# EAGLE design Juice Rescue v1.0 (EAGLE 9.6.2)
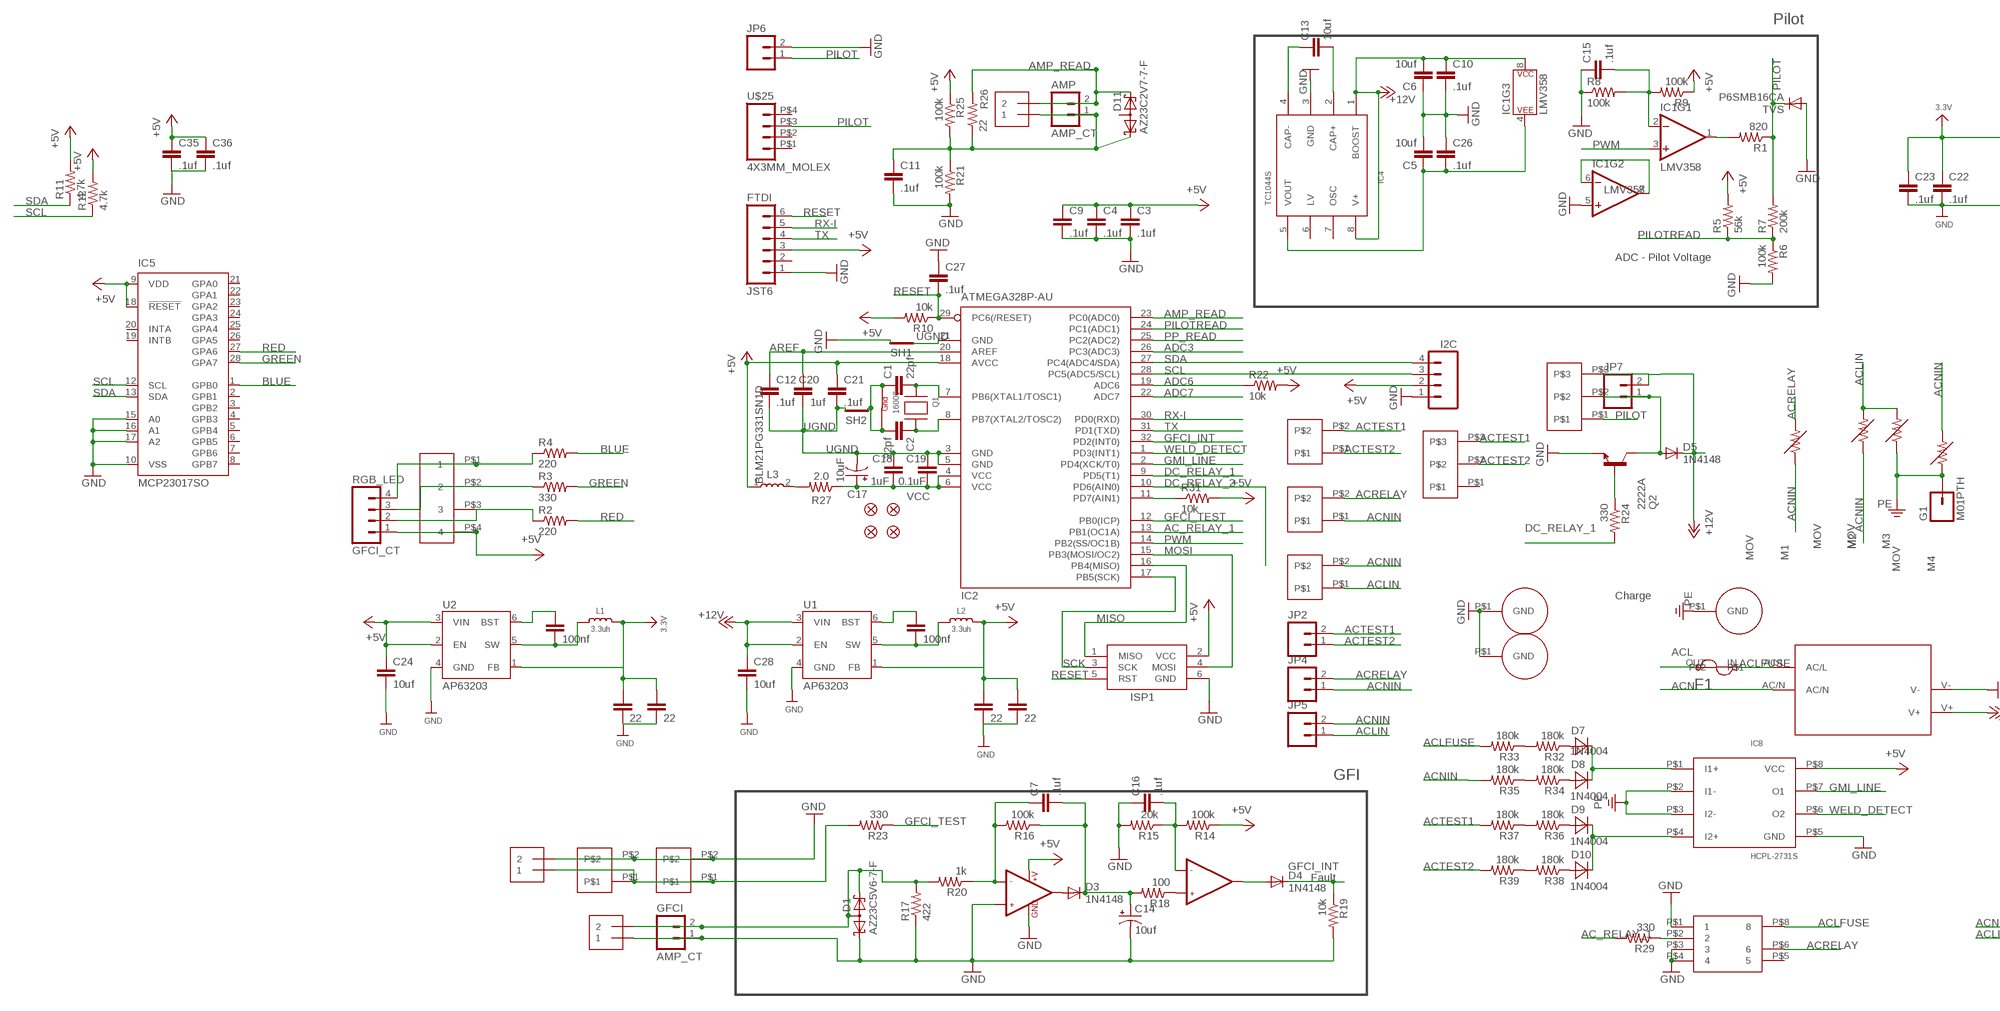
[diagram p0: schematic, sheet 1, part 1 of 2]
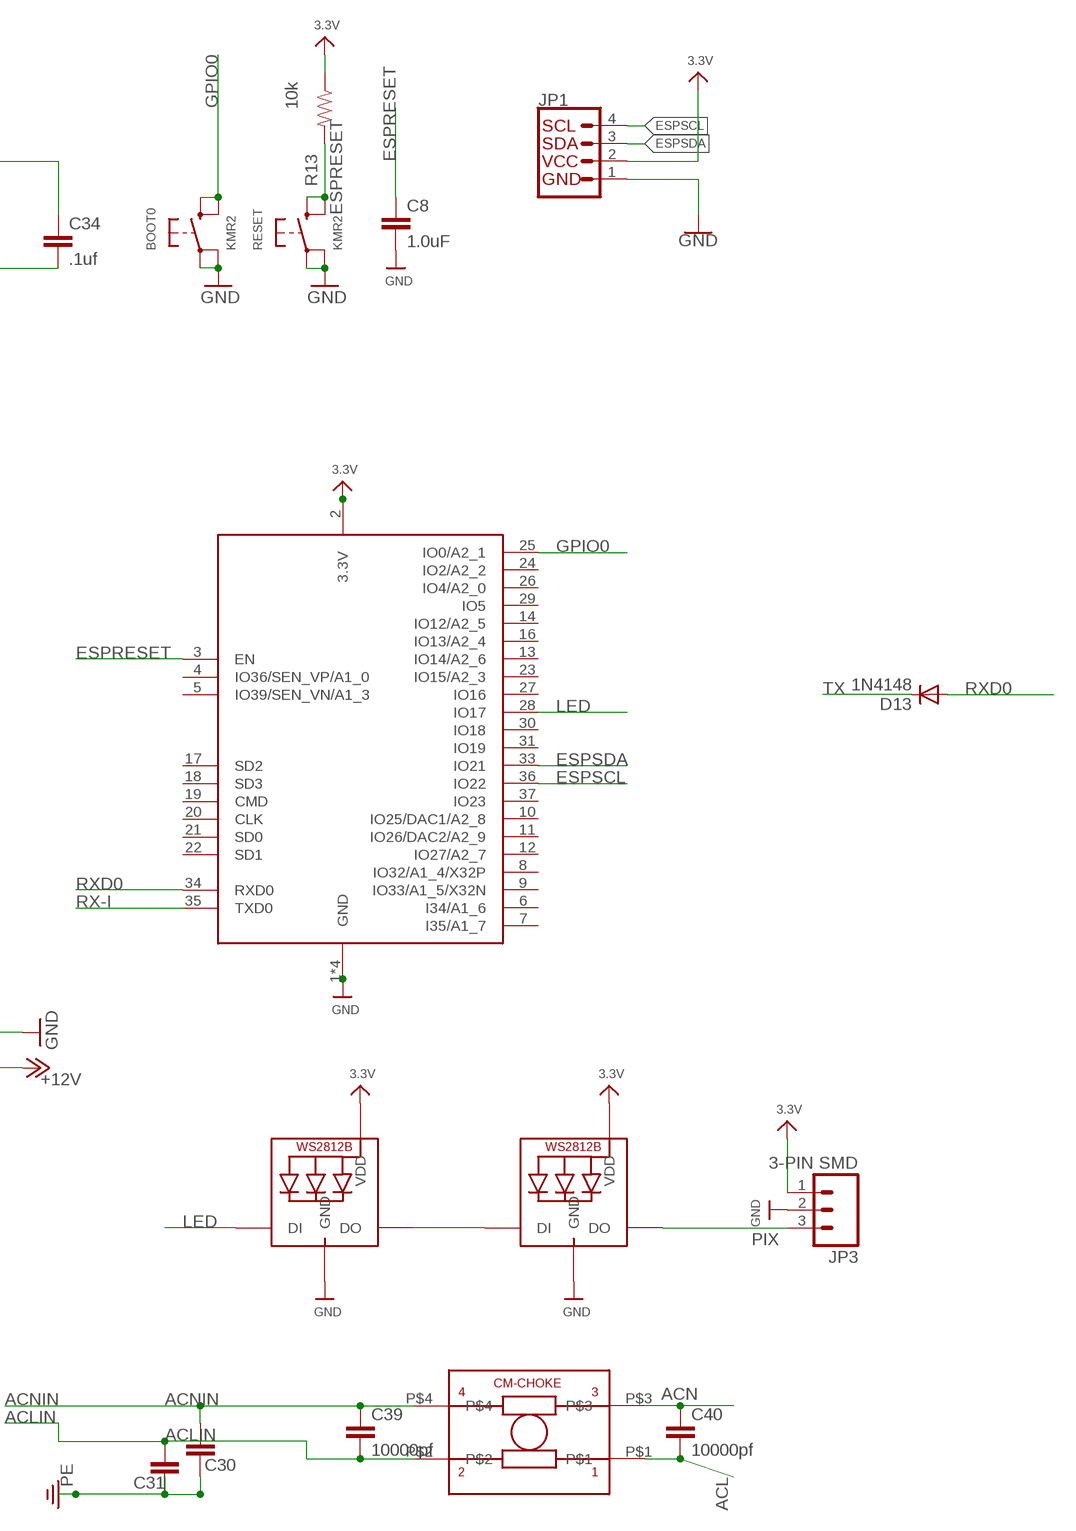
[diagram p1: schematic, sheet 1, part 2 of 2]

## Parts
AMP  AMP_CT  MOLEX_2  [MOLEX_2]
BOOT0  KMR2  SWITCH_TACT_SMT4.6X2.8  [BTN_KMR2_4.6X2.8]
C1  22pf  CAP0805  [0805]
C2  22pf  CAP0805  [0805]
C3  .1uf  CAP0805  [0805]
C4  .1uf  CAP0805  [0805]
C5  10uf  CAP0805  [0805]
C6  10uf  CAP0805  [0805]
C7  .1uf  CAP0805  [0805]
C8  1.0uF  1.0UF-0805-25V-(+80/-20%)  [0805]
C9  .1uf  CAP0805  [0805]
C10  .1uf  CAP0805  [0805]
C11  .1uf  CAP0805  [0805]
C12  .1uf  CAP0805  [0805]
C13  10uf  CAP0805  [0805]
C14  10uf  CAP_POL1206  [EIA3216]
C15  .1uf  CAP0805  [0805]
C16  .1uf  CAP0805  [0805]
C17  10uF  10UF-POLAR-0603-6.3V-20%(TANT)  [0603-POLAR]
C18  1uF  CAP0805  [0805]
C19  0.1uF  CAP0805  [0805]
C20  1uf  CAP0805  [0805]
C21  .1uf  CAP0805  [0805]
C22  .1uf  1.0UF-0805-25V-(+80/-20%)  [0805]
C23  .1uf  1.0UF-0805-25V-(+80/-20%)  [0805]
C24  10uf  1.0UF-0805-25V-(+80/-20%)  [0805]
C25  22  1.0UF-0805-25V-(+80/-20%)  [0805]
C26  .1uf  CAP0805  [0805]
C27  .1uf  CAP0805  [0805]
C28  10uf  1.0UF-0805-25V-(+80/-20%)  [0805]
C29  22  1.0UF-0805-25V-(+80/-20%)  [0805]
C30  100nf  1.0UF-0805-25V-(+80/-20%)  [0805]
C31  22  1.0UF-0805-25V-(+80/-20%)  [0805]
C32  100nf  1.0UF-0805-25V-(+80/-20%)  [0805]
C33  22  1.0UF-0805-25V-(+80/-20%)  [0805]
C34  .1uf  1.0UF-0805-25V-(+80/-20%)  [0805]
C35  .1uf  CAP0805  [0805]
C36  .1uf  CAP0805  [0805]
C37  1000pf  DK1  [DK1E3EA]
C38  1000pf  DK1  [DK1E3EA]
C39  10000pf  C7.5/4  [C7.5B4]
C40  10000pf  C7.5/4  [C7.5B4]
CMC  RN214-0.3-02-47M  [RN214-0.3-02-47M]
D1  AZ23C5V6-7-F  BAS40-06  [SOT23]
D3  1N4148  DIODE-SOD123  [SOD123]
D4  1N4148  DIODE-SOD123  [SOD123]
D5  1N4148  DIODE-SOD123  [SOD123]
D7  1N4004  MBRA340T3  [SMA]
D8  1N4004  MBRA340T3  [SMA]
D9  1N4004  MBRA340T3  [SMA]
D10  1N4004  MBRA340T3  [SMA]
D11  AZ23C2V7-7-F  BAS40-06  [SOT23]
D13  1N4148  DIODE-SOD123  [SOD123]
F1  BEL1.6AFUSE  BEL1AFUSE  [BELFUSE1A]
FID1  FIDUCIAL1X2.5  [FIDUCIAL-1X2.5]
FID2  FIDUCIAL1X2.5  [FIDUCIAL-1X2.5]
FID3  FIDUCIAL1X2.5  [FIDUCIAL-1X2.5]
FID4  FIDUCIAL1X2.5  [FIDUCIAL-1X2.5]
FTDI  JST6  [JST6]
G1  M01PTH  [1X01]
GFCI  AMP_CT  MOLEX_2  [MOLEX_2]
I2C  M04JST-PTH-VERT  [JST-4-PTH-VERT]
IC1  LMV358  LMV358SOIC  [SO08]
IC2  ATMEGA328P-AU  MEGA8-AI  [TQFP32-08]
IC3  LM358  LMV358  [SO08]
IC4  TC1044S  [SO-8]
IC5  MCP23017SO  [SO28W]
IC7  AQH2223  [SIL8]
IC8  HCPL-2731S  [SIL8-2]
ISP1  ISP1  AVRISP-6  [AVRISP]
J1  1X2-3.5MM  [1X2-3.5MM]
J2  1X2-3.5MM  [1X2-3.5MM]
J3  1X2-3.5MM  [1X2-3.5MM]
JP1  QWIIC_CONNECTORJS-1MM  [JST04_1MM_RA]
JP2  M025MM  [SCREWTERMINAL-5MM-2]
JP3  3-PIN SMD  M03JST-SMD  [JST-3-SMD]
JP4  M025MM  [SCREWTERMINAL-5MM-2]
JP5  M025MM  [SCREWTERMINAL-5MM-2]
JP6  M025MM  [SCREWTERMINAL-5MM-2]
JP7  M025MM  [SCREWTERMINAL-5MM-2]
L1  3.3uh  MICROBUILDER_INDUCTORNR5040  [MICROBUILDER_INDUCTOR_5X5MM_NR5040_NOTHERMALS]
L2  3.3uh  MICROBUILDER_INDUCTORNR5040  [MICROBUILDER_INDUCTOR_5X5MM_NR5040_NOTHERMALS]
L3  BLM21PG331SN1D  [INDC2012X87]
LED1  WS2812B3535  [LED3535]
LED2  WS2812B3535  [LED3535]
M1  MOV  [MOV]
M2  MOV  [MOV]
M3  MOV  [MOV]
M4  MOV  [MOV]
PS1  IRM-10-5  [IRM-10-5]
Q1  16000  XTAL-4-3225  [NX3225]
Q2  2222A  BCX70SMD  [SOT23]
R1  820  RESISTOR0805-RES  [0805]
R2  220  RESISTOR0805-RES  [0805]
R3  330  RESISTOR0805-RES  [0805]
R4  220  RESISTOR0805-RES  [0805]
R5  56k  RESISTOR0805-RES  [0805]
R6  100k  RESISTOR0805-RES  [0805]
R7  200k  RESISTOR0805-RES  [0805]
R8  100k  RESISTOR0805-RES  [0805]
R9  100k  RESISTOR0805-RES  [0805]
R10  10k  RESISTOR0805-RES  [0805]
R11  4.7k  RESISTOR0805-RES  [0805]
R12  4.7k  RESISTOR0805-RES  [0805]
R13  10k  RESISTOR0805  [0805]
R14  100k  RESISTOR0805-RES  [0805]
R15  20k  RESISTOR0805-RES  [0805]
R16  100k  RESISTOR0805-RES  [0805]
R17  422  RESISTOR0805-RES  [0805]
R18  100  RESISTOR0805-RES  [0805]
R19  10k  RESISTOR0805-RES  [0805]
R20  1k  RESISTOR0805-RES  [0805]
R21  100k  RESISTOR0805-RES  [0805]
R22  10k  RESISTOR0805-RES  [0805]
R23  330  RESISTOR0805-RES  [0805]
R24  330  RESISTOR0805-RES  [0805]
R25  100k  RESISTOR0805-RES  [0805]
R26  22  R-US_R1206  [R1206]
R27  2.0  RESISTOR0805-RES  [0805]
R29  330  RESISTOR0805-RES  [0805]
R31  10k  RESISTOR0805-RES  [0805]
R32  180k  0.1OHM-1/2W-1%(1210)  [1210]
R33  180k  0.1OHM-1/2W-1%(1210)  [1210]
R34  180k  0.1OHM-1/2W-1%(1210)  [1210]
R35  180k  0.1OHM-1/2W-1%(1210)  [1210]
R36  180k  0.1OHM-1/2W-1%(1210)  [1210]
R37  180k  0.1OHM-1/2W-1%(1210)  [1210]
R38  180k  0.1OHM-1/2W-1%(1210)  [1210]
R39  180k  0.1OHM-1/2W-1%(1210)  [1210]
RESET  KMR2  SWITCH_TACT_SMT4.6X2.8  [BTN_KMR2_4.6X2.8]
RGB_LED  GFCI_CT  GFCI_4  [GFCI_4]
SH1  SHORT-HT5  [SHORT_TOP-50]
SH2  SHORT-HT5  [SHORT_TOP-50]
TVS  P6SMB16CA  DIODE-SMB  [SMB]
U1  AP63203  [SOT23-6]
U2  AP63203  [SOT23-6]
U$1  AMPAC  [AMPAC]
U$3  HOLE  [HOLE]
U$8  AMPAC  [AMPAC]
U$9  HOLE  [HOLE]
U$14  AMPAC  [AMPAC]
U$17  AMPAC  [AMPAC]
U$20  AMP3POS  [AMP3POS]
U$22  AMPAC3P  [ACAMP3P]
U$23  2X4MM  [2X4MM]
U$24  4X1MMRIBBON  [4X1MMRIBBON]
U$25  4X3MM_MOLEX  [4X3MM_MOLEX]
U$27  HOLE  [HOLE]
X2  ESP32-WROOM-32  ESP32_WROOM32_SKINNY  [WROOM32_SKINNY]

## Nets
3.3V: C22.1 C23.1 C25.1 C31.1 C34.1 JP1.2 JP3.1 L1.P$2 LED1.2(VDD) LED2.2(VDD) R13.1 U2.1(FB) X2.2(3.3V)
+5V: C3.1 C4.1 C9.1 C21.1 C24.1 C29.1 C33.1 C35.1 C36.1 FTDI.3 I2C.2 IC2.18(AVCC) IC3.8(+V) IC5.9(VDD) IC5.18(!RESET) IC8.P$8(VCC) ISP1.2(VCC) L2.P$2 L3.1 R5.2 R9.1 R10.2 R11.2 R12.2 R14.1 R22.2 R25.1 R31.2 RGB_LED.1 U1.1(FB) U2.2(EN) U2.3(VIN) U$24.P$4
+12V: C6.2 C10.1 C28.1 D5.C IC1.8(P$V+) IC4.1(BOOST) IC4.8(V+) JP7.2 PS1.V+ U1.2(EN) U1.3(VIN) U$20.P$3
-12V1: C5.1 C26.2 IC1.4(P$V-) IC4.5(VOUT)
AC_RELAY_1: IC2.13(PB1(OC1A)) R29.2
ACL: C40.2 CMC.P$1 F1.OUT
ACLFUSE: F1.IN IC7.P$8 PS1.AC/L R33.2
ACLIN: C38.P$2 C39.2 CMC.P$2 JP5.1 M2.P$2 M3.P$2 U$1.P$1
ACN: C40.1 CMC.P$3 PS1.AC/N
ACNIN: C37.P$2 C39.1 CMC.P$4 JP4.1 JP5.2 M1.P$1 M2.P$1 M4.P$2 R35.2 U$1.P$2 U$8.P$1
ACRELAY: IC7.P$6 JP4.2 M1.P$2 U$8.P$2
ACTEST1: JP2.2 R37.2 U$14.P$2 U$22.P$3
ACTEST2: JP2.1 R39.2 U$14.P$1 U$22.P$2
ADC3: IC2.26(PC3(ADC3))
ADC6: IC2.19(ADC6) R22.1
ADC7: IC2.22(ADC7)
AMP_READ: AMP.2 D11.2(K2) IC2.23(PC0(ADC0)) J3.2 R26.2
AREF: C12.1 C20.1 IC2.20(AREF)
BLUE: IC5.1(GPB0) R4.2
DAMP: L3.2 R27.2
DC_RELAY_1: IC2.9(PD5(T1)) R24.2
DC_RELAY_1_O: D5.A JP7.1 Q2.3(C) U$20.P$2
DC_RELAY_1_T: Q2.1(B) R24.1
DC_RELAY_2: IC2.10(PD6(AIN0))
ESPRESET: C8.1 R13.2 RESET.B'(S1) RESET.B(S) X2.3(EN)
ESPSCL: JP1.4 X2.36(IO22)
ESPSDA: JP1.3 X2.33(IO21)
GFCI_INT: D4.C IC2.32(PD2(INT0)) R19.1
GFCI_TEST: IC2.12(PB0(ICP)) R23.1
GFI_TEST_O: J2.1 R23.2 U$17.P$1 U$23.P$1
GMI_LINE: IC2.2(PD4(XCK/T0)) IC8.P$7(O1)
GND: BOOT0.A'(P1) BOOT0.A(P) C3.2 C4.2 C5.2 C6.1 C8.2 C9.2 C10.2 C11.2 C14.C(-) C15.1 C16.1 C22.2 C23.2 C24.2 C25.2 C26.1 C27.1 C28.2 C29.2 C31.2 C33.2 C34.2 C35.2 C36.2 D1.1(K1) FTDI.1 GFCI.1 I2C.1 IC1.5(+IN) IC3.3(+IN1) IC3.4(GND) IC4.3(GND) IC5.10(VSS) IC5.15(A0) IC5.16(A1) IC5.17(A2) IC7.P$1 IC7.P$3 IC7.P$4 IC8.P$5(GND) ISP1.6(GND) J1.1 J2.2 JP1.1 JP3.2 JP6.2 LED1.4(GND) LED2.4(GND) PS1.V- Q2.2(E) R6.2 R8.1 R15.2 R17.1 R19.2 R21.2 RESET.A'(P1) RESET.A(P) SH1.2 TVS.A U1.4(GND) U2.4(GND) U$9.P$1(GND) U$17.P$2 U$23.P$2 U$27.P$1(GND) X2.1(GND) X2.15(GND) X2.38(GND) X2.P$1(GND)
GPIO0: BOOT0.B'(S1) BOOT0.B(S) X2.25(IO0/A2_1)
GREEN: IC5.28(GPA7) R3.2
LED: LED1.1(DI) X2.28(IO17)
MISO: IC2.16(PB4(MISO)) ISP1.1(MISO)
MOSI: IC2.15(PB3(MOSI/OC2)) ISP1.4(MOSI)
N$1: D9.C D10.C IC8.P$4(I2+)
N$2: D7.C D8.C IC8.P$1(I1+)
N$4: C1.2 IC2.7(PB6(XTAL1/TOSC1)) Q1.2(X1)
N$5: C2.1 IC2.8(PB7(XTAL2/TOSC2)) Q1.4(X2)
N$6: D7.A R32.1
N$7: AMP.1 C11.1 D11.1(K1) J3.1 R21.1 R25.2 R26.1
N$8: C7.1 IC3.2(-IN1) R16.2 R20.1
N$9: D8.A R34.1
N$10: C15.2 IC1.2(-IN) R8.2 R9.2
N$11: IC1.1(OUT) R1.2
N$12: IC2.11(PD7(AIN1)) R31.1
N$13: R32.2 R33.1
N$14: IC1.6(-IN) IC1.7(OUT)
N$15: C32.1 U1.6(BST)
N$16: C32.2 L2.P$1 U1.5(SW)
N$17: R34.2 R35.1
N$18: IC7.P$2 R29.1
N$19: C13.2 IC4.2(CAP+)
N$20: D1.2(K2) D1.3(AA) GFCI.2 J1.2 R17.2 R20.2
N$21: D3.A IC3.1(OUT1)
N$22: R36.2 R37.1
N$23: C7.2 C14.A(+) D3.C R16.1 R18.2
N$24: C16.2 IC3.6(-IN2) R14.2 R15.1
N$25: D4.A IC3.7(OUT2)
N$26: IC3.5(+IN2) R18.1
N$27: C13.1 IC4.4(CAP-)
N$28: R38.2 R39.1
N$29: D9.A R36.1
N$30: D10.A R38.1
N$31: R3.1 RGB_LED.3 U$24.P$2
N$32: R2.1 RGB_LED.2 U$24.P$3
N$33: LED1.3(DO) LED2.1(DI)
N$34: C30.1 U2.6(BST)
N$35: C30.2 L1.P$1 U2.5(SW)
N$36: R4.1 RGB_LED.4 U$24.P$1
PE: C37.P$1 C38.P$1 G1.1 IC8.P$2(I1-) IC8.P$3(I2-) M3.P$1 M4.P$1 U$3.P$1(GND)
PILOT: JP6.1 R1.1 R7.2 TVS.C U$20.P$1 U$25.P$3
PILOTREAD: IC2.24(PC1(ADC1)) R5.1 R6.1 R7.1
PIX: JP3.3 LED2.3(DO)
PP_READ: IC2.25(PC2(ADC2))
PWM: IC1.3(+IN) IC2.14(PB2(SS/OC1B))
RED: IC5.27(GPA6) R2.2
RESET: C27.2 FTDI.6 IC2.29(PC6(/RESET)) ISP1.5(RST) R10.1
RX-I: FTDI.5 IC2.30(PD0(RXD)) X2.35(TXD0)
RXD0: D13.A X2.34(RXD0)
SCK: IC2.17(PB5(SCK)) ISP1.3(SCK)
SCL: I2C.3 IC2.28(PC5(ADC5/SCL)) IC5.12(SCL) R12.1
SDA: I2C.4 IC2.27(PC4(ADC4/SDA)) IC5.13(SDA) R11.1
TX: D13.C FTDI.4 IC2.31(PD1(TXD))
UGND: C12.2 C17.- C18.1 C19.1 C20.2 C21.2 IC2.3(GND) IC2.5(GND) IC2.21(GND) SH1.1 SH2.2
VCC: C17.+ C18.2 C19.2 IC2.4(VCC) IC2.6(VCC) R27.1
WELD_DETECT: IC2.1(PD3(INT1)) IC8.P$6(O2)
XGND: C1.1 C2.2 Q1.1(G1) Q1.3(G2) SH2.1
Unconnected: D11.3(AA) FTDI.2 IC4.6(LV) IC4.7(OSC) IC5.2(GPB1) IC5.3(GPB2) IC5.4(GPB3) IC5.5(GPB4) IC5.6(GPB5) IC5.7(GPB6) IC5.8(GPB7) IC5.19(INTB) IC5.20(INTA) IC5.21(GPA0) IC5.22(GPA1) IC5.23(GPA2) IC5.24(GPA3) IC5.25(GPA4) IC5.26(GPA5) IC7.P$5 U$22.P$1 U$25.P$1 U$25.P$2 U$25.P$4 X2.4(IO36/SEN_VP/A1_0) X2.5(IO39/SEN_VN/A1_3) X2.6(I34/A1_6) X2.7(I35/A1_7) X2.8(IO32/A1_4/X32P) X2.9(IO33/A1_5/X32N) X2.10(IO25/DAC1/A2_8) X2.11(IO26/DAC2/A2_9) X2.12(IO27/A2_7) X2.13(IO14/A2_6) X2.14(IO12/A2_5) X2.16(IO13/A2_4) X2.17(SD2) X2.18(SD3) X2.19(CMD) X2.20(CLK) X2.21(SD0) X2.22(SD1) X2.23(IO15/A2_3) X2.24(IO2/A2_2) X2.26(IO4/A2_0) X2.27(IO16) X2.29(IO5) X2.30(IO18) X2.31(IO19) X2.37(IO23)

## Notes on the sheet
- Pilot
- ADC - Pilot Voltage
- Charge
- GFI
- Fault

## Library data of the parts
AMP GFCI = OpenEVSE:MOLEX_2
BOOT0 RESET = microbuilder:SWITCH_TACT_SMT: SMT Tact Switches 6x6mm - Digikey: P12940SCT-ND KMR2 (4.6x2.8mm) - Digikey: 401-1426-1-ND EVQ-PQHB55 - Light Touch, 160GF (4.5x4.5mm) - Digikey: P8090SCT-ND KMT0 - KMT021 NGJ LHS (etc.) IP68/Waterproof - Digikey: CKN10289CT-ND
C1-C7 C9-C13 C15 C16 C18-C21 C26 C27 C35 C36 = SparkFun:CAP: Capacitor Standard 0603 ceramic capacitor, and 0.1" leaded capacitor.
C8 = SparkFun-Capacitors:1.0UF: 1µF ceramic capacitors A capacitor is a passive two-terminal electrical component used to store electrical energy temporarily in an electric field.; PROD_ID: CAP-11625
C14 = SparkFun:CAP_POL: Capacitor Polarized These are standard SMD and PTH capacitors. Normally 10uF, 47uF, and 100uF in electrolytic and tantalum varieties. Always verify the external diameter of the through hole cap, it varies with capacity, voltage, and manufacturer. The EIA devices should be standard.
C17 = SparkFun-Capacitors:10UF-POLAR: 10.0µF polarized capacitors A capacitor is a passive two-terminal electrical component used to store electrical energy temporarily in an electric field.; PROD_ID: CAP-13210
C22-C25 C28-C34 = SparkFun-Capacitors:1.0UF: 1µF ceramic capacitors A capacitor is a passive two-terminal electrical component used to store electrical energy temporarily in an electric field.; PROD_ID: CAP-11625; VALUE: 1.0uF
C37 C38 = OpenEVSE:DK1
C39 C40 = capacitor-wima:C: CAPACITOR naming: grid - package width
CMC = Schaffner-CM-Choke:RN214-0.3-02-47M
D1 D11 = diode:BAS40-06: Silicon Schottky Diodes General-purpose diode for high-speed switching
D3-D5 D13 TVS = diode:DIODE-: DIODE
D7-D10 = diode:MBRA340T3: Surface Mount Schottky Power Rectifier Source: http://www.onsemi.com/pub_link/Collateral/MBRA340T3-D.PDF
F1 = Qxd:BEL1AFUSE
FID1-FID4 = SparkFun-Retired:FIDUCIAL: Fiducial Alignment Points Various fiducial points for machine vision alignment.
FTDI = OpenEVSE:JST6
G1 = SparkFun:M01: Header 1 Standard 1-pin 0.1" header. Use with straight break away headers (SKU : PRT-00116), right angle break away headers (PRT-00553), swiss pins (PRT-00743), machine pins (PRT-00117), and female headers (PRT-00115).
I2C = SparkFun-Connectors:M04: Header 4 Standard 4-pin 0.1" header. Use with straight break away headers (SKU : PRT-00116), right angle break away headers (PRT-00553), swiss pins (PRT-00743), machine pins (PRT-00117), and female headers (PRT-00115). Molex polarized connector foot print use with SKU : PRT-08231 with associated crimp pins and housings. 1MM SMD Version SKU: PRT-10208
IC1 = SparkFun-IC-Amplifiers:LMV358: IC LMV358 DUAL OP AMP Jellybean rail-to-rail output op-amp SparkFun Products SparkFun PicoBoard <https://www.sparkfun.com/products/11888> (WIG-11888) SparkFun Vernier Interface Shield <https://www.sparkfun.com/products/12858> (DEV-12858) SparkFun Blynk Board - ESP8266 <https://www.sparkfun.com/products/13794> (WRL-13794) SparkFun Digital Sandbox <https://www.sparkfun.com/products/12651> (DEV-12651 RoHS); PROD_ID: IC-09657
IC2 = atmel:MEGA8: MICROCONTROLLER 8 Kbytes FLASH, 1 kbytes SRAM, 512 bytes EEPROM, USART, 6-channel 10 bit ADC, 2-channel 8 bit ADC Pin compatible with Atmega48, ATMega88, ATMega168 Source: avr.lbr; MPN: ATMEGA8-16AU; OC_FARNELL: 9171371; OC_NEWARK: 73M8863
IC3 = SparkFun:LMV358
IC4 = OpenEVSE:TC1044S
IC5 = adafruit:MCP23017: http://ww1.microchip.com/downloads/en/DeviceDoc/21952a.pdf Source: http://ww1.microchip.com/downloads/en/DeviceDoc/21952a.pdf
IC7 = OpenEVSE:AQH2223
IC8 = OpenEVSE:HCPL-2731S
ISP1 = adafruit:AVRISP: AVR ISP HEADER Standard 6 pin header for AVR programming
J1-J3 = adafruit:1X2: 3.5mm Terminal block http://www.ladyada.net/library/pcb/eaglelibrary.html
JP1 = SparkFun-Connectors:QWIIC_CONNECTOR: SparkFun I2C Standard Qwiic Connector An SMD 1mm pitch JST connector makes it easy and quick (get it? Qwiic?) to connect I2C devices to each other. The Qwiic system <http://www.sparkfun.com/qwiic> enables fast and solderless connection between popular platforms and various sensors and actuators. We carry 200mm <https://www.sparkfun.com/products/14204>, 100mm <https://www.sparkfun.com/products/14205>, 50mm <https://www.sparkfun.com/products/14206>, and breadboard friendly <https://www.sparkfun.com/products/14207> Qwiic cables. We also offer 10 pcs strips <https://www.sparkfun.com/products/14323> the SMD connectors.; PROD_ID: CONN-13694
JP2 JP4-JP7 = SparkFun-Connectors:M02: Standard 2-pin 0.1" header. Use with - straight break away headers ( PRT-00116) - right angle break away headers (PRT-00553) - swiss pins (PRT-00743) - machine pins (PRT-00117) - female headers (PRT-00115) Molex polarized connector foot print use with: PRT-08233 with associated crimp pins and housings. 2.54_SCREWTERM for use with PRT-10571. 3.5mm Screw Terminal footprints for PRT-08084 5mm Screw Terminal footprints for use with PRT-08432; STOREFRONT_ID: PRT-08432
JP3 = SparkFun-Connectors:M03: Header 3 Standard 3-pin 0.1" header. Use with straight break away headers (SKU : PRT-00116), right angle break away headers (PRT-00553), swiss pins (PRT-00743), machine pins (PRT-00117), and female headers (PRT-00115). Molex polarized connector foot print use with SKU : PRT-08232 with associated crimp pins and housings.; PROD_ID: CONN-12591
L1 L2 = ESP32_v1_SMPS:MICROBUILDER_INDUCTOR: Inductors 0603: 10nH Ceramic Inductor - microwire antenna/RF (Digikey: 712-1434-2-ND) 0805: 560nH Ceramic Inductor - RF (Digikey: 553-1047-1-ND) 270nH Ceramic Inductor - Q = 40@250MHz, +-5%, 1 Ohm DC Resistance (Digikey: 535-10506-2-ND) 1007 (2518 Metric) SMT: 10µH 10% 250mOhm 820mA 1007 Inductor (Digikey: 587-2189-1-ND) 22µH 10% 500mOhm 580mA 1007 Inductor (Digikey: 587-2190-1-ND) 47µH 10% 950mOhm 420mA 1007 Inductor (Digikey: 587-2191-1-ND) 47µH 5% 100mOhm 1A 1008 Inductor (Digikey: 732-1816-1-ND) 5.0x5.0mm (Taiyo Yuden NR5040 Series) 6.8µH 20% 2.3A 64mOhm Inductor (Digikey: 587-2374-2-ND) 5.0x5.0mm (TDK VLC5045 Series) 4.7µH 20% 3.3A 34mOhm Inductor (Digikey: 445-6526-1-ND) 6.8µH 20% 2.7A 46mOhm Inductor (Digikey: 445-6527-1-ND) 6.0x6.0mm (TDK VLC6045 Series) 4.7µH 20% 3.8A 27mOhm Inductor (Digikey: 445-6538-2-ND) 6.8µH 20% 3A 41mOhm Inductor (Digikey: 445-6540-1-ND) 6.2µH 30% 2.2A 45mOhm Inductor (Digikey: SRR5028-6R2YCT-ND) - Not TDK VLC6045 but footprint should match 6.0x6.0mm (TDK SLF6045 Series) 6.8uH 30% 2A 33mOhm Inductor (Digikey: 445-4572-1-ND, Mouser: 810-SLF645T6R8N2R0PF) 6.0x6.0mm (Sumida CDRH5D28 Series) 6.2uH 30% 1.8A 45mOhm Inductor (Digikey: 308-1542-1-ND) Taiyo Yuden NR3015T2R2M - 2.2uH 20% 1.5A (Digikey: 587-1648-2-ND, Mouser: 963-NR3015T2R2M) - Used with TI TPS62172 CoilCraft RFID Transponder Coil - MA5532-AE (For use with AS3935 Lightning Sensor)
L3 = BLM21PG331SN1D:BLM21PG331SN1D: Ferrite Beads Multi-Layer 330Ohm 25% 100MHz 1.5A 70mOhm DCR 0805 Paper T/R; DESCRIPTION: Ferrite Beads Multi-Layer 330Ohm 25% 100MHz 1.5A 70mOhm DCR 0805 Paper T/R; MF: Murata; MP: BLM21PG331SN1D; PACKAGE: 0805 Murata
LED1 LED2 = adafruit:WS2812B
M1-M4 = OpenEVSE:MOV
PS1 = OpenEVSE:IRM-10-5
Q1 = adafruit:XTAL-4: Classic 4-pin 3.2 x 2.5mm crystal
Q2 = transistor-npn:BCX70*: NPN Transistor
R1-R12 R14-R25 R27 R29 R31 = SparkFun:RESISTOR: Resistor Basic schematic elements and footprints for 0603, 1206, and PTH resistors.
R13 = SparkFun-Resistors:RESISTOR: Generic Resistor Package
R26 = rcl:R-US_: RESISTOR, American symbol
R32-R39 = SparkFun-Resistors:0.1OHM-1/2W-1%(1210); PROD_ID: RES-12374
RGB_LED = OpenEVSE:GFCI_4
SH1 SH2 = shorts-old:SHORT-H: Short between two nets; BOM: no
U1 U2 = SparkFun-IC-Power:AP63203: Diodes Inc. AP63203 3.8V-32V input 3.3V Buck The AP63200/AP63201/AP63203/AP63205 is a 2A, synchronous buck converter with a wide input voltage range of 3.8V to 32V and fully integrates a 125mΩ high-side power MOSFET and a 68mΩ lowside power MOSFET to provide high-efficiency step-down DC/DC conversion; PROD_ID: VREG-15244
U$1 U$8 U$14 U$17 = OpenEVSE:AMPAC
U$3 U$9 U$27 = OpenEVSE:HOLE
U$20 = OpenEVSE:AMP3POS
U$22 = OpenEVSE:AMPAC3P
U$23 = OpenEVSE:2X4MM
U$24 = OpenEVSE:4X1MMRIBBON
U$25 = OpenEVSE:4X3MM_MOLEX
X2 = microbuilder:ESP32_WROOM32

## Board
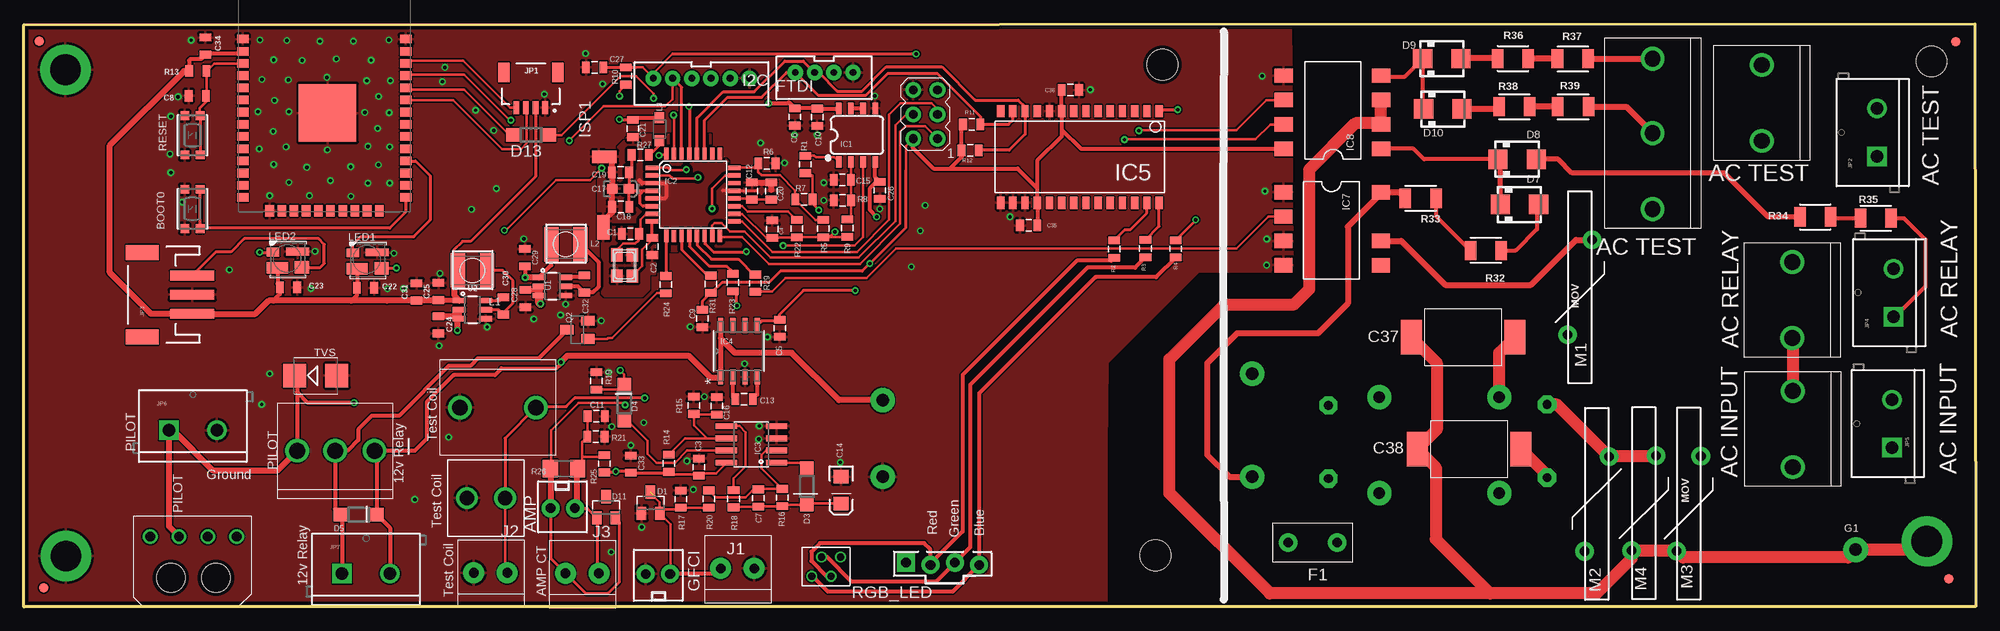
[diagram p2: board, top side]
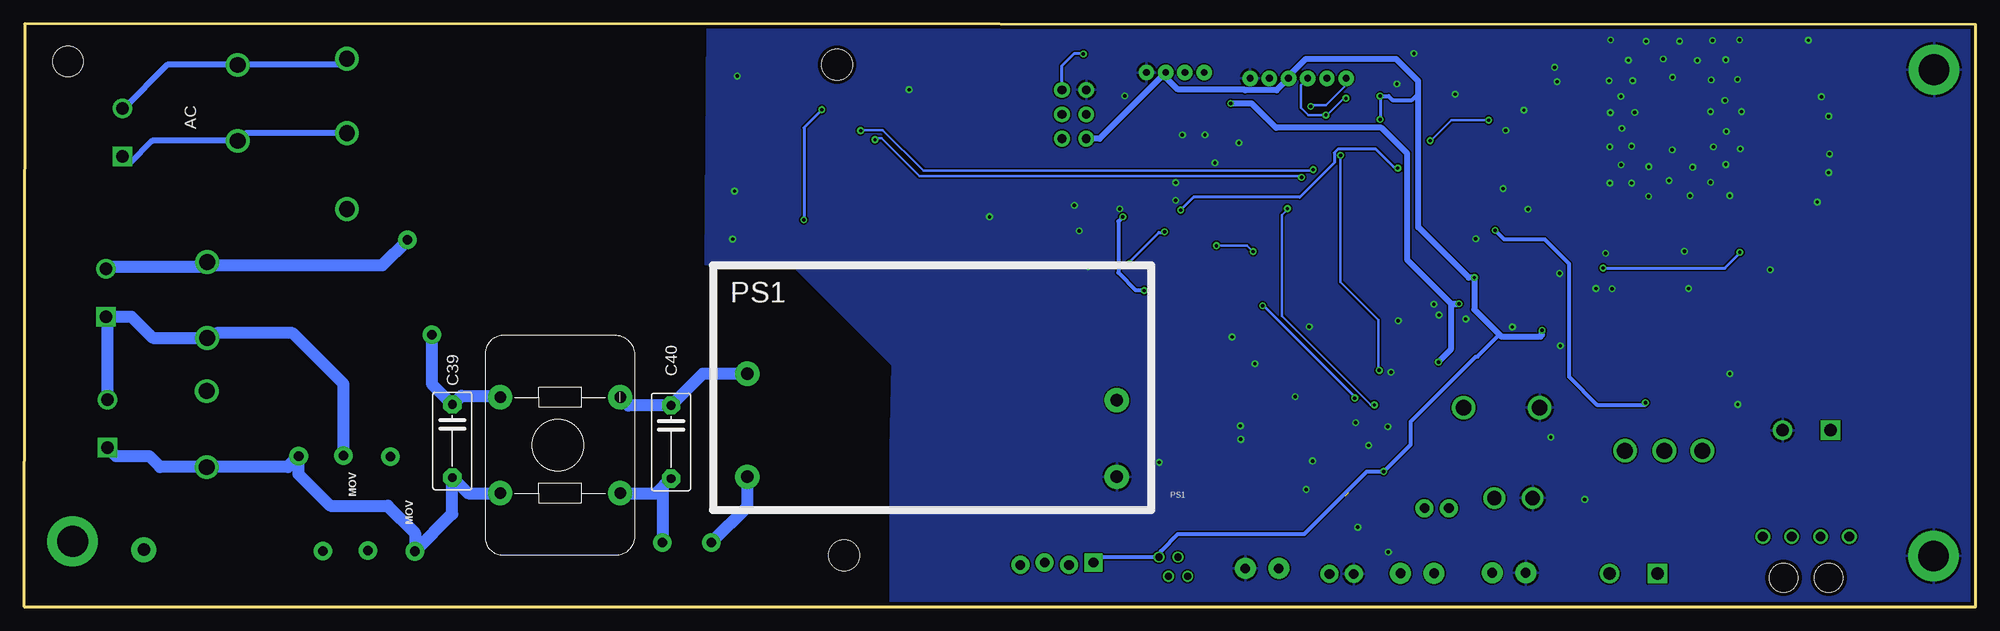
[diagram p3: board, bottom side, seen from below]

Size 203.37 x 60.79 mm. Coordinates in mm from the lower left corner, seen from the top.
Outline: 203.3,60.79 203.37,0.03 0,0 0,60.72 203.3,60.79
Copper layers (1*16): Top 0.0356mm / dielectric 1.5011mm / Bottom 0.0356mm
Design rules "default": minimum track width 6mil, minimum drill 13mil, track to track 6mil, track to pad 6mil, pad to pad 6mil, via to via 6mil, smd to smd 6mil, copper to edge 15mil, drill to drill 6mil, minimum pad ring 7mil, minimum via ring 7mil, stop-mask expansion 4mil, vias tented up to drill 0mil, thermal gap 10mil
Holes 3.2 mm at 198.8,56.88 118.64,56.55 117.91,5.4

### Footprints (pad centres in the part's own frame; a part is rotated, then mirrored left to right if it is on the bottom)
MOLEX_2 = drill 1.016 pad 1.88: 1 -1.27,0; 2 1.27,0
BTN_KMR2_4.6X2.8 = smd 0.9 x 0.9: A 2.05,0.8; A' -2.05,0.8; B 2.05,-0.8; B' -2.05,-0.8
0805 = smd 0.8 x 1.2: 1 -0.9,0; 2 0.9,0
EIA3216 = smd 1.4 x 1.6: A 1.4,0; C -1.4,0
0603-POLAR = smd 1.1 x 1: + 0.85,0; - -0.85,0
DK1E3EA = smd 2.2 x 3.6: P$1 -5.4,0; P$2 5.4,0
C7.5B4 = drill 0.914 pad 1.905 octagon: 1 -3.81,0; 2 3.81,0
RN214-0.3-02-47M = drill 1.2 pad 2.54: P$1 14,6.5; P$2 1.5,6.5; P$3 14,16.5; P$4 1.5,16.5
SOT23 = smd 1 x 1.4: 1 -0.95,-1.1; 2 0.95,-1.1; 3 0,1.1
SOD123 = smd 1.4 x 1.4: A 1.9,0; C -1.9,0
SMA = smd 2 x 2: A 2,0; C -2,0
BELFUSE1A = drill 1 pad 1.93: IN 2,1.66; OUT 2,6.74
FIDUCIAL-1X2.5 = smd 1 x 1: 1 0,0
JST6 = drill 0.7 pad 1.6: 1 -5,-0.28; 2 -3,-0.28; 3 -1,-0.28; 4 1,-0.28; 5 3,-0.28; 6 5,-0.28
1X01 = drill 1.31 pad 2.6: 1 0,0
JST-4-PTH-VERT = drill 0.7 pad 1.6: 1 -3,-0.55; 2 -1,-0.55; 3 1,-0.55; 4 3,-0.55
SO08 = smd 0.6 x 1.2: 1 -1.905,-2.8; 2 -0.635,-2.8; 3 0.635,-2.8; 4 1.905,-2.8; 5 1.905,2.8; 6 0.635,2.8; 7 -0.635,2.8; 8 -1.905,2.8
TQFP32-08 = smd 1.27 x 0.457: 1 -4.293,2.8; 2 -4.293,2; 3 -4.293,1.2; 4 -4.293,0.4; 5 -4.293,-0.4; 6 -4.293,-1.2; 7 -4.293,-2; 8 -4.293,-2.8; 17 4.293,-2.8; 18 4.293,-2; 19 4.293,-1.2; 20 4.293,-0.4; 21 4.293,0.4; 22 4.293,1.2; 23 4.293,2; 24 4.293,2.8 | smd 0.457 x 1.27: 9 -2.8,-4.293; 10 -2,-4.318; 11 -1.2,-4.293; 12 -0.4,-4.293; 13 0.4,-4.293; 14 1.2,-4.293; 15 2,-4.293; 16 2.8,-4.293; 25 2.8,4.293; 26 2,4.293; 27 1.2,4.293; 28 0.4,4.293; 29 -0.4,4.293; 30 -1.2,4.293; 31 -2,4.293; 32 -2.8,4.293
SO08' = smd 0.61 x 2.21: 1 -1.905,-2.616; 2 -0.635,-2.616; 3 0.635,-2.616; 4 1.905,-2.616; 5 1.905,2.616; 6 0.635,2.616; 7 -0.635,2.616; 8 -1.905,2.616
SO-8 = smd 1.549 x 0.559: 1 -2.68,1.905; 2 -2.68,0.635; 3 -2.68,-0.635; 4 -2.68,-1.905; 5 2.68,-1.905; 6 2.68,-0.635; 7 2.68,0.635; 8 2.68,1.905
SO28W = smd 0.762 x 1.27: 1 -7.62,-4.78; 2 -6.35,-4.78; 3 -5.08,-4.78; 4 -3.81,-4.78; 5 -2.54,-4.78; 6 -1.27,-4.78; 7 0,-4.78; 8 1.27,-4.78; 9 2.54,-4.78; 10 3.81,-4.78; 11 5.08,-4.78; 12 6.35,-4.78; 13 7.62,-4.78; 14 8.89,-4.78; 15 8.89,4.78; 16 7.62,4.78; 17 6.35,4.78; 18 5.08,4.78; 19 3.81,4.78; 20 2.54,4.78; 21 1.27,4.78; 22 0,4.78; 23 -1.27,4.78; 24 -2.54,4.78; 25 -3.81,4.78; 26 -5.08,4.78; 27 -6.35,4.78; 28 -7.62,4.78
SIL8 = smd 1.5 x 1.9: P$1 -4,-5; P$2 -1.46,-5; P$3 1.08,-5; P$4 3.62,-5; P$5 3.62,5.16; P$6 1.08,5.16; P$8 -4,5.16
SIL8-2 = smd 1.5 x 1.9: P$1 -4,-5; P$2 -1.46,-5; P$3 1.08,-5; P$4 3.62,-5; P$5 3.62,5.16; P$6 1.08,5.16; P$7 -1.46,5.16; P$8 -4,5.16
AVRISP = drill 0.9 pad 1.626: 1 -1.27,2.54; 2 1.27,2.54; 3 -1.27,0; 4 1.27,0; 5 -1.27,-2.54; 6 1.27,-2.54
1X2-3.5MM = drill 1 pad 2.184: 1 1.8,0; 2 -1.7,0
JST04_1MM_RA = smd 0.6 x 1.35: 1 -1.5,0; 2 -0.5,0; 3 0.5,0; 4 1.5,0 | smd 1.2 x 2: NC1 2.8,-3.675; NC2 -2.8,-3.675
SCREWTERMINAL-5MM-2 = drill 1.3 pad 2.032 square: 1 0,0 | drill 1.3 pad 2.032: 2 5,0
JST-3-SMD = smd 1 x 4.6: 1 -1.99,-4.77; 2 0.01,-4.77; 3 2.01,-4.77 | smd 1.6 x 3.4: NC1 -4.39,0.43; NC2 4.41,0.43
MICROBUILDER_INDUCTOR_5X5MM_NR5040_NOTHERMALS = smd 1.5 x 3.6: P$1 -1.55,0; P$2 1.5,0
INDC2012X87 = smd 1.15 x 1: 1 -1.175,0; 2 1.175,0
LED3535 = smd 1.3 x 0.9: 1 -1.55,0.775 | smd 2.2 x 1.2: 2 -1.1,-0.875 | smd 1.5 x 1.3: 3 1.45,-0.825 | smd 2.4 x 0.8: 4 1,0.825
MOV = drill 1 pad 1.93: P$1 0,1.27; P$2 9.89,-1.27
IRM-10-5 = drill 1.3 pad 2.54: AC/L 3.6,3.45; AC/N 3.6,14.2; V+ 42.1,11.45; V- 42.1,3.45
NX3225 = smd 1.4 x 1.2: 1 -1.1,0.8; 2 1.1,0.8; 3 1.1,-0.8; 4 -1.1,-0.8
R1206 = smd 1.6 x 1.803: 1 -1.422,0; 2 1.422,0
1210 = smd 1.2 x 2: 1 -1.6,0; 2 1.6,0
GFCI_4 = drill 1.016 pad 1.88 square: 1 0,0.127 | drill 1.016 pad 1.88: 2 2.54,-0.127; 3 5.08,0.127; 4 7.62,-0.127
SHORT_TOP-50 = smd 1.27 x 1.27: 1 0.635,0; 2 -0.635,0
SMB = smd 2.4 x 2.4: A 2.2,0; C -2.2,0
SOT23-6 = smd 0.55 x 1.35: 1 -0.95,-1.375; 2 0,-1.375; 3 0.95,-1.375; 4 0.95,1.375; 5 0,1.375; 6 -0.95,1.375
AMPAC = drill 1.65: P$1 0,3.96; P$2 0,-3.96
HOLE = drill 3.2 pad 5.25: P$1 0,0
AMP3POS = drill 1.65: P$1 0,3.96; P$2 0,0; P$3 0,-4.11
ACAMP3P = drill 1.65: P$1 0,7.77; P$2 0,-0.15; P$3 0,-7.92
2X4MM = drill 1.5: P$1 0,2; P$2 0,-2
4X1MMRIBBON = drill 0.75: P$1 -2,-1; P$2 -1,1; P$3 0,-1; P$4 1,1
4X3MM_MOLEX = drill 1.02: P$1 4.5,3; P$2 1.5,3; P$3 -1.5,3; P$4 -4.5,3 | hole 3: -2.35,-1.32; 2.35,-1.32
WROOM32_SKINNY = smd 1.2 x 0.9: 1 -8.5,5; 2 -8.5,3.73; 3 -8.5,2.46; 4 -8.5,1.19; 5 -8.5,-0.08; 6 -8.5,-1.35; 7 -8.5,-2.62; 8 -8.5,-3.89; 9 -8.5,-5.16; 10 -8.5,-6.43; 11 -8.5,-7.7; 12 -8.5,-8.97; 13 -8.5,-10.24; 14 -8.5,-11.51; 25 8.5,-11.51; 26 8.5,-10.24; 27 8.5,-8.97; 28 8.5,-7.7; 29 8.5,-6.43; 30 8.5,-5.16; 31 8.5,-3.89; 32 8.5,-2.62; 33 8.5,-1.35; 34 8.5,-0.08; 35 8.5,1.19; 36 8.5,2.46; 37 8.5,3.73; 38 8.5,5 | smd 0.9 x 1.2: 15 -5.7,-12.9; 16 -4.43,-12.9; 17 -3.16,-12.9; 18 -1.89,-12.9; 19 -0.62,-12.9; 20 0.65,-12.9; 21 1.92,-12.9; 22 3.19,-12.9; 23 4.46,-12.9; 24 5.73,-12.9 | smd 6 x 6: P$1 0.34,-2.7

### Placement (x,y rotation side)
AMP  56.14,10.31 180 top
BOOT0  17.56,41.51 90 top
C1  63.2,38.91 0 top
C2  65.47,37.6 270 top
C3  70.35,14.58 90 top
C4  77.98,39.4 90 top
C5  78.75,29.07 270 top
C6  80.35,51.09 90 top
C7  76.54,11.36 270 top
C8  18.07,53.3 180 top
C9  70.7,30.08 270 top
C10  82.66,51.06 270 top
C11  59.64,19.89 0 top
C12  75.86,43.37 90 top
C13  75.04,21.68 180 top
C14  85.15,12.18 270 top
C15  85.28,44.53 0 top
C16  72.18,20.96 270 top
C17  62.18,43.6 0 top
C18  62.2,41.73 0 top
C19  62.17,45.34 0 top
C20  77.86,43.37 90 top
C21  63.46,49.89 270 top
C22  35.59,33.28 0 top
C23  27.57,33.33 0 top
C24  43.16,29.42 270 top
C25  43.19,32.9 90 top
C26  89.19,43.44 90 top
C27  59.47,56.27 0 top
C28  52.25,32.17 270 top
C29  52.2,36.43 90 top
C30  49.94,31.4 270 top
C31  40.9,32.85 90 top
C32  58.38,33.69 270 top
C33  63.23,14.89 90 top
C34  18.9,58.48 90 top
C35  104.71,39.79 180 top
C36  109.05,53.91 0 top
C37  149.97,28.13 0 top
C38  150.6,16.47 0 top
C39  158.73,17.31 270 bottom
C40  135.95,17.21 270 bottom
CMC  155.25,5.37 0 bottom
D1  65.29,10.86 0 top
D3  81.57,12.58 90 top
D4  62.56,21.3 270 top
D5  34.88,9.63 180 top
D7  155.85,41.98 0 top
D8  155.6,46.68 0 top
D9  147.76,57.16 0 top
D10  147.86,51.93 0 top
D11  60.66,10.4 0 top
D13  52.84,49.21 180 top
F1  130.1,8.73 270 top
FID1  200.59,2.96 0 top
FID2  1.58,58.99 0 top
FID3  201.3,58.94 0 top
FID4  2.04,2.02 0 top
FTDI  70.59,54.85 180 top
G1  190.89,5.98 0 top
GFCI  66.07,3.44 0 top
I2C  83.39,55.18 180 top
IC1  86.81,49.21 0 top
IC2  69.73,42.99 0 top
IC3  LM358  [SO08']  75.81,16.95 90 top
IC4  74.5,26.68 90 top
IC5  110.67,46.92 180 top
IC7  136.25,39.25 270 top
IC8  136.43,51.77 90 top
ISP1  93.93,51.37 180 top
J1  74.3,4.02 0 top
J2  48.57,3.57 0 top
J3  58.12,3.51 0 top
JP1  52.81,52.05 180 top
JP2  193.1,46.97 90 top
JP3  12.76,32.55 90 top
JP4  194.85,30.29 90 top
JP5  194.7,16.62 90 top
JP6  15.09,18.42 0 top
JP7  33.15,3.46 0 top
L1  46.72,35.09 180 top
L2  56.45,37.83 180 top
L3  66.22,49.82 270 top
LED1  35.82,36.15 0 top
LED2  27.51,36.23 0 top
M1  162.14,28.39 90 top
M2  163.9,15.7 270 top
M3  173.48,5.83 90 top
M4  168.8,5.88 90 top
PS1  131.58,10.12 0 bottom
Q1  62.59,35.61 90 top
Q2  57.68,28.9 90 top
R1  81.41,46.14 90 top
R2  113.6,37.32 90 top
R3  116.87,37.37 90 top
R4  120.05,37.35 90 top
R5  83.29,39.46 270 top
R6  77.42,46.28 0 top
R7  81.28,42.48 0 top
R8  85.29,42.4 0 top
R9  85.8,39.51 90 top
R10  62.72,55.36 270 top
R11  98.76,50.33 180 top
R12  98.61,47.63 180 top
R13  18.12,55.89 0 top
R14  67.18,14.98 90 top
R15  69.78,21.03 90 top
R16  79.01,11.41 90 top
R17  68.44,11.25 270 top
R18  73.95,11.28 270 top
R19  59.65,23.57 90 top
R20  71.36,11.27 270 top
R21  59.6,17.76 0 top
R22  80.52,39.46 270 top
R23  73.87,33.83 270 top
R24  66.87,33.61 90 top
R25  60.47,14.94 90 top
R26  56.27,14.41 180 top
R27  64.22,47.12 0 top
R29  76.2,33.77 90 top
R31  71.58,33.66 270 top
R32  152.36,37.17 180 top
R33  145.55,42.61 180 top
R34  186.67,40.68 0 top
R35  192.98,40.55 0 top
R36  155.18,57.18 0 top
R37  161.4,57.16 0 top
R38  155.33,52.16 0 top
R39  161.45,52.16 0 top
RESET  17.56,49.18 90 top
RGB_LED  91.93,4.51 0 top
SH1  60.49,46.94 0 top
SH2  60.38,39.58 270 top
TVS  30.41,24.12 0 top
U1  55.07,33.44 270 top
U2  46.74,31 270 top
U$1  184.33,18.55 180 top
U$3  198.3,6.84 0 top
U$8  184.28,32.01 180 top
U$9  4.32,56.03 0 top
U$14  181.11,52.56 180 top
U$17  49.38,20.79 270 top
U$20  32.42,16.29 90 top
U$22  169.73,49.26 180 top
U$23  48.14,11.36 270 top
U$24  84.11,4.2 0 top
U$25  17.66,4.35 0 top
U$27  4.38,5.32 0 top
X2  31.3,54.21 0 top

### Tracks (layer width: path | path; a pad name or v marks a point on that pad's centre or on a via)
3.3V
  Top 0.305: JP1.2 53.31,44.88 46.54,38.11 45.7,38.11 44.74,37.14 44.74,34.98 44.89,34.83 | 44.89,35.42 L1.P$2 44.94,34.81 44.94,32.38 U2.1 | 26.72,33.39 C23.1 | 34.64,33.23 C22.1
  Top 0.406: X2.2 22.55,57.69 19.01,57.69 C34.1 18.46,57.13 17.35,57.13 17.22,57 R13.1 | LED1.2 34.72,33.31 34.64,33.23 | C22.1 34.69,32.5 34.14,31.95 | LED2.2 26.41,33.69 26.72,33.39 | C23.1 26.67,32.63 25.99,31.95
  Top 0.508: U2.1 43.24,31.95
  Top 0.61: 43.24,31.95 C25.1 43.14,31.95 C31.1 37.8,31.95 34.14,31.95 25.99,31.95 25.5,31.95 24.11,30.56 JP3.1 13.25,30.56 8.95,34.86 8.95,48.15 16.68,55.89 R13.1 | U2.1 44.89,32.43 44.89,34.83 44.89,35.42
+5V  (via drill 0.35)
  Top 0.254: R9.1 85.75,38.56 83.32,38.56 R5.2 R22.2 80.47,38.5 C4.1 77.33,38.5 74.85,40.99 IC2.18 | IC3.8 72.1,13.95 70.62,13.95 C3.1 70.19,13.83 67.43,13.83 | 67.43,13.83 67.17,13.83 | 67.43,13.83 R14.1 | R10.2 62.06,53.8 v62.06,53.27 | 91.9,45.54 91.9,48.08 ISP1.2
  Top 0.305: 91.9,45.54 91.9,39.54 88.32,35.96 88.29,35.96 v88.13,35.81 87.35,35.02 78.84,35.02 77.63,33.82 72.73,33.82 71.67,32.76 R31.2 70.7,31.88 C9.1 | v84.51,39.13 83.95,38.56 83.32,38.56 | R25.1 61.58,14.04 v61.68,14.13 61.75,14.21 63.01,14.21 C33.1 67.01,13.99 67.17,13.83 | v62.06,50.83 63.41,50.83 C21.1
  Top 0.406: C29.1 52.2,34.55 52.23,34.53 v52.23,34.35 | U1.1 54.95,35.63 L2.P$2 | C21.1 63.68,51 L3.1 | ISP1.2 92.66,47.84 94.78,45.73 96.53,45.73 | 96.53,45.73 97.71,46.91 R12.2 97.71,50.17 R11.2 | 96.53,45.73 103.54,45.73 105.59,43.67 IC5.18 | IC5.18 C35.1 | IC5.18 105.59,46.52 108.13,49.06 IC5.9 | IC5.9 108.13,53.89 C36.1 | IC5.9 108.13,49.79 110.15,47.77 IC8.P$8
  Top 0.508: 44.69,30.32 U2.2 U2.3
  Top 0.61: U1.1 53.66,34.35 v52.23,34.35 | v45.17,28.84 45.17,29.85 U2.3 45.18,30.24 45.07,30.24 44.98,30.32 44.69,30.32 C24.1
  Bottom 0.305: v88.13,35.81 88.13,36.01 85.1,39.05 84.51,39.05 v84.51,39.13 | v62.06,53.27 62.01,53.22 62.01,50.83 v62.06,50.83 | 84.91,5.81 85.11,5.62 U$24.P$4
  Bottom 0.406: v62.06,53.27 61.17,53.27 60.76,52.87 58.73,52.87 58.07,53.53 | 61.55,14.13 v61.68,14.13 | v61.68,14.13 58.86,16.95 58.86,19.34 52.08,26.12 51.9,26.12 49.7,28.32 49.7,28.5 | v61.68,14.13 63.43,14.13 69.95,7.61 83.11,7.61 84.91,5.81 | U$24.P$4 91.36,5.2 RGB_LED.1
  Bottom 0.508: FTDI.3 71.59,55.35
  Bottom 0.61: v45.17,28.84 45.17,28.38 45.35,28.2 49.41,28.2 49.7,28.5 52.23,31.02 v52.23,34.35 52.81,34.35 58.07,39.61 58.07,53.53 58.07,54.85 60.38,57.16 69.78,57.16 71.59,55.35 | FTDI.3 72.85,53.87 76.11,53.87 76.2,53.96 83.09,53.96 84.39,55.26 I2C.2 91.29,48.83 ISP1.2
+12V  (via drill 0.35)
  Top 0.305: IC4.1 72.54,24
  Top 0.406: 72.51,23.97 72.54,24 | v77.63,52.51 79.56,52.51 79.61,52.56 79.77,52.56 C6.2 82.63,51.99 C10.1 84.86,51.96 IC1.8 | C28.1 52.19,33 52.44,33.07 53.57,33.07 53.7,33.2 U1.2 | v55.96,25.54 55.96,25.36 55.48,24.88 49.76,24.88 49.08,24.19 44.79,24.19 41.97,21.37 41.97,17.54 40.72,16.29 U$20.P$3 37.23,15.59 36.78,15.15 D5.C 38.15,8.26 JP7.2
  Top 0.508: IC4.8 72.6,28 IC4.1
  Top 0.61: v55.96,25.54 56.65,26.22 69.25,26.22 71.56,23.91 72.45,23.91 72.51,23.97 | PS1.V+ 84.92,21.57 79.99,26.5 74.1,26.5 72.6,28
  Top 0.813: v53.83,31.61 53.7,31.74 U1.3 53.7,33.2
  Bottom 0.61: v55.96,25.54 55.99,25.54 54.69,26.83 54.69,31.61 v53.83,31.61 54.62,31.61 59.24,36.23 59.24,47.3 61.91,49.97 72.9,49.97 75.44,52.51 v77.63,52.51
-12V1  (via drill 0.35)
  Top 0.305: v86.62,33 81.24,33 78.75,30.51 C5.1 78.62,29.84 76.89,29.84 IC4.5
  Top 0.406: v88.86,40.67 88.17,41.36 88.17,43.7 88.78,44.31 89.22,44.31 | C26.2 88.71,44.81 IC1.4
  Top 0.508: 89.22,44.31 C26.2
  Bottom 0.406: v88.86,40.67 89.34,40.19 89.34,34.86 87.48,33 v86.62,33
AC_RELAY_1
  Top 0.305: IC2.13 70.16,38.67 70.16,37.73 71.63,36.26 74.45,36.26 76.04,34.67 R29.2
ACL
  Bottom 1.27: CMC.P$1 137.47,11.87 C40.2 136.84,12.5 F1.OUT
ACLFUSE
  Top 0.61: R33.2 143.3,43.25 IC7.P$8 141.41,43.12 137.95,39.66 137.95,31.63 134.85,28.53 126.42,28.53 123.3,25.41 123.3,15.88 125.61,13.57 PS1.AC/L
  Bottom 1.27: F1.IN 127.98,10.51 PS1.AC/L
ACLIN
  Top 1.27: C39.2 158.73,13.74 C38.P$2
  Bottom 1.27: JP5.1 193.81,15.73 190.33,15.73 189.19,14.59 U$1.P$1 175.88,14.59 M3.P$2 174.75,13.84 171.46,10.55 165.46,10.55 162.63,7.72 M2.P$2 158.73,9.71 C39.2 157.1,11.87 CMC.P$2
ACN
  Bottom 1.27: PS1.AC/N 132.64,24.32 C40.1 140.4,21.02 CMC.P$3
ACNIN
  Top 0.406: JP4.1 195.03,30.29 198.15,33.41 198.15,38.31 195.92,40.55 R35.2
  Top 1.27: U$8.P$1 184.33,28 U$1.P$2 | M4.P$2 169.99,15.7 M2.P$1 159.75,21.12 C39.1 | CMC.P$4 153.75,26.51 C37.P$2
  Bottom 1.27: JP5.2 194.7,30.13 JP4.1 192.18,30.29 189.95,28.05 U$8.P$1 184.41,27.93 184.41,27.42 183.27,28.56 175.39,28.56 170.07,23.24 M4.P$2 | CMC.P$4 153.59,22.03 157.82,22.03 C39.1 160.87,23.26 M1.P$1
ACRELAY
  Top 0.61: IC7.P$6 143.53,38.17 148.11,33.59 157.05,33.59 161.75,38.28 M1.P$2
  Bottom 1.27: JP4.2 194.62,35.51 184.74,35.51 U$8.P$2 183.96,35.65 166.04,35.65 M1.P$2
ACTEST1
  Top 0.61: R37.2 169.71,57.16 U$22.P$3
  Bottom 0.61: U$22.P$3 170.39,56.52 U$14.P$2 188.43,56.52 192.97,51.97 JP2.2
ACTEST2
  Top 0.61: R39.2 166.98,52.16 U$22.P$2
  Bottom 0.61: U$22.P$2 180.19,49.41 181.06,48.55 U$14.P$1 190,48.6 192.36,46.24 JP2.1
ADC6
  Top 0.254: IC2.19 74.84,41.79 75.4,41.23 79.64,41.23 80.51,40.36 R22.1
AMP_READ  (via drill 0.35)
  Top 0.254: v71.71,41.54 71.71,43.65 73.06,44.99 IC2.23 | v62.64,21.07 62.41,21.29 57.82,21.29 54.92,18.4 54.92,14.23
  Top 0.305: AMP.2 54.87,5.07 J3.2 58.5,1.43 60.86,1.43 62.01,2.57 62.01,8.9 D11.2
  Top 0.61: 54.92,14.23 54.85,14.31 R26.2 54.87,14.39 AMP.2
  Bottom 0.254: v71.71,41.54 71.71,41.46 72.29,40.88 72.29,30.36 63,21.07 v62.64,21.07
AREF
  Top 0.254: C20.1 C12.1 75.73,42.6 IC2.20
BLUE  (via drill 0.35)
  Top 0.305: IC5.1 118.47,51.88 120.2,51.88 v120.22,51.85 | v122.1,40.37 122.1,40.3 R4.2
  Bottom 0.305: v120.22,51.85 122.1,49.97 v122.1,40.37
DAMP
  Top 0.305: L3.2 66.06,48.49 66.06,48 65.18,47.12 R27.2
DC_RELAY_1
  Top 0.254: 66.93,34.57 R24.2
  Top 0.305: IC2.9 66.93,34.57
DC_RELAY_1_O
  Top 0.406: Q2.3 53.61,25.92 47.3,25.92 46.54,25.16 44.28,25.16 39.07,19.95 39.07,19.92 36.25,19.92 34.83,18.5 34.83,17.41 33.71,16.29 U$20.P$2 32.42,10.2 D5.A 33.15,9.46 JP7.1
DC_RELAY_1_T
  Top 0.254: R24.1 65.98,32.71 61.3,28.03 60.89,28.03 60.79,27.92 58.81,27.92 Q2.1
ESPRESET
  Top 0.254: X2.3 19.8,56.67 R13.2 19.02,53.35 | 18.32,52.03 18.32,51.44
  Top 0.305: 18.32,51.44 18.32,51.27 RESET.B RESET.B' | 19.02,53.35 C8.1 18.97,52.67 18.32,52.03
ESPSCL
  Top 0.254: JP1.4 50.68,52.05 45.76,56.98 40.1,56.98 X2.36
ESPSDA
  Top 0.254: JP1.3 52.38,51.99 52.38,48.35 51.8,47.76 49.82,47.76 44.71,52.86 X2.33
GFCI_INT  (via drill 0.35)
  Top 0.254: IC2.32 66.8,47.15 66.17,47.15 v66.17,47.1 | v62.13,24.67 62.56,24.25 D4.C 62.42,23.2 62.4,23.1 61.96,22.67 R19.1
  Bottom 0.254: v66.17,47.1 66.17,33.89 62.21,29.93 62.21,24.67 v62.13,24.67
GFCI_TEST
  Top 0.305: IC2.12 69.35,38.68 69.35,37.6 71.41,35.54 73.23,35.54 73.87,34.9 R23.1
GFI_TEST_O  (via drill 0.35)
  Top 0.254: 54.06,20.48 53.75,20.79 U$17.P$1 | U$23.P$1 50.14,3.8 J2.1
  Top 0.305: v64.69,21.79 57.4,21.79 56.5,20.89 54.46,20.89 54.06,20.48 | v74.28,31.4 74.28,32.53 R23.2 | U$17.P$1 50.14,17.58 U$23.P$1
  Bottom 0.305: v64.69,21.79 64.69,21.89 74.17,31.38 74.25,31.38 v74.28,31.4
GMI_LINE  (via drill 0.35)
  Top 0.254: IC2.2 67.29,44.99 67.62,44.66 70.11,44.66 v70.24,44.79 | IC8.P$7 129.89,50.31 128.35,48.78 114.74,48.78 v114.69,48.73
  Bottom 0.254: v70.24,44.79 70.38,44.94 110.06,44.94 114.01,48.88 114.53,48.88 v114.69,48.73
GND  (via drill 0.35)
  other vias: 83.34,42.4 83.34,44.26 89.19,41.51 93.91,41.87 93.4,39.23 92.46,35.47 129.04,55.36 88.65,53.3 82.66,49.23 80.3,49.23 76.77,48.4 79.25,46.31 77.48,28.15 75.09,25.36 69.42,29.22 76.61,18.88 76.56,17.48 85.07,15.07 69.09,15.22 70.9,21.93 64.6,19.21 63.25,16.85 61.2,5.72 44.25,17.71 55.91,30.44 53.12,30.03 56.45,31.56 52.08,38.39 60.31,54.54 60.92,24.47 61.25,18.81 25.61,42.88 38.03,59.12 24.59,59.12 27.41,59.06 30.84,58.99 34.32,58.99 36.18,57.01 32.54,57.13 28.99,56.98 26.02,57.06 24.8,55 27.54,54.95 26.12,52.82 27.62,51.65 24.39,51.65 31.6,47.66 31.58,55.23 25.97,49.59 35.52,51.57 35.72,54.87 38.18,54.87 36.96,53.25 38.06,51.55 36.86,49.89 35.85,48.04 38.11,47.96 36.94,46.11 24.52,47.76 27.31,47.96 26.02,46.14 29.47,45.86 34.04,45.91 38.11,44.21 35.85,44.21 31.93,44.46 27.62,44.28 29.75,42.88 34.07,42.81 43.87,56.27 17.43,59.09 16.06,53.2 15.3,51.16 15.22,47.23 15.3,45.3 16.49,42.22 54.24,53.48 39.55,33.21 21.39,35.16 30.33,37.09 38.54,36.89 43.26,27.24 43.34,34.78 48.27,29.19 37.88,33.18 29.9,33.21 25.61,24.32 49.23,43.62 46.64,41.46 48.95,49.69 47.07,51.8 43.59,54.77 40.72,11.21 24.77,21.12 129.32,43.37 129.52,38.36 129.5,35.65 102.75,40.7 111.13,53.93 64.37,8.32 69.75,12.25 60.15,29.85 58.53,57.72
  pour Bottom: -8.68,79.3 132,79.11 132.37,35.77 123.45,35.77 112.88,25.21 113.05,16.46 113.05,-14.8 -8.14,-9.35
  pour Top (rank 3): -7.85,83.18 131.94,82.17 132.19,34.97 122.44,34.97 112.9,25.42 112.82,16.48 112.82,-13.37 -7.85,-11.78
GPIO0
  Top 0.305: X2.25 39.8,41.18 38.13,39.51 18.4,39.51 BOOT0.B' BOOT0.B
GREEN
  Top 0.305: R3.2 118.29,39.7 IC5.28
LED
  Top 0.305: X2.28 40.8,46.51 42.35,44.97 42.35,40.42 42.35,40.34 40.62,38.62 35.08,38.62 34.27,37.8 LED1.1
MISO
  Top 0.254: IC2.16 72.53,38.59 74.83,38.59 77.66,35.76 87.12,35.76 91.31,39.96 91.31,49.56 91.88,50.12 93.91,50.12 ISP1.1
MOSI
  Top 0.254: IC2.15 71.73,39.75 71.99,40.01 72.7,40.01 73.56,39.15 75.08,39.15 77.82,36.41 86.98,36.41 90.8,40.23 90.8,50.23 91.97,51.4 91.99,51.37 ISP1.4
N$1
  Top 0.406: IC8.P$4 141.52,55.31 143.9,55.31 D9.C 145.76,52.03 D10.C
N$2
  Top 0.406: D8.C 145.9,46.68 144.81,47.77 IC8.P$1
  Top 0.508: D7.C 153.85,46.43 D8.C
N$4
  Top 0.254: IC2.7 64.84,40.99 64.25,40.4 64.25,39.06 C1.2 64.04,38.85 64.04,38.21 63.71,37.88 62.41,37.88 61.79,37.26 Q1.2
N$5
  Top 0.254: Q1.4 64.42,35.54 64.42,37.25 65.44,38.26 65.44,38.53
  Top 0.305: C2.1 65.44,38.53 IC2.8
N$6
  Top 0.406: D7.A 157.67,41.8 157.67,39.39 155.46,37.17 R32.1
N$7
  Top 0.254: 58.15,15.63 58.15,14.77 57.64,14.26 | 58.15,15.63 58.15,17.21 R21.1 58.74,17.8 C11.1 | R25.2 60.26,15.63 58.15,15.63 | 57.61,14.41 R26.1
  Top 0.305: AMP.1 58.7,10.31 D11.1 59.71,3.72 J3.1 | R26.1 57.64,14.36 57.64,14.26
  Top 0.61: 57.61,14.41 57.61,10.51 AMP.1
N$8
  Top 0.254: C7.1 76.59,12.31 R16.2 76.87,14.46 76.87,15.86 77.33,16.32 IC3.2 | R20.1 72.04,11.48 72.04,11.44 75.22,11.44 75.88,12.1 76.6,12.1 76.62,12.12
  Top 0.305: C7.1 76.62,12.18 76.62,12.12
N$9
  Top 0.508: R34.1 181.77,40.68 177.2,45.25 161.32,45.25 159.89,46.68 D8.A
N$10
  Top 0.254: R9.2 86.19,40.8 R8.2 86.18,42.41 C15.2 IC1.2
N$11
  Top 0.254: IC1.1 84.42,46.9 82.53,46.9 82.34,47.04 R1.2
N$12
  Top 0.305: IC2.11 68.53,37.28 71.24,34.56 R31.1
N$13
  Top 0.406: R32.2 147.15,40.78 R33.1
N$14
  Top 0.406: IC1.7 IC1.6
N$15
  Top 0.406: C32.1 58.17,34.39 U1.6
N$16
  Top 0.406: U1.5 57.73,33.44 C32.2 59.28,32.79 59.87,33.39 59.87,35.95 L2.P$1
N$17
  Top 0.406: R34.2 188.2,40.55 R35.1
N$18
  Top 0.254: IC7.P$2 129.68,40.71 126.35,37.39 90.88,37.39 87.79,34.29 79.34,34.29 77.96,32.9 76.23,32.9 R29.1
N$19
  Top 0.406: C13.2 73.87,21.94 IC4.2
N$20  (1 unrouted)
  Top 0.254: R20.2 71.33,10.34 R17.2 68.29,10.2 66.68,10.2 D1.2 | D1.2 67.39,8.62 67.39,3.49 GFCI.2 | D1.2 66.24,10.91 65.67,11.49 | D1.3
  Top 0.305: 65.67,11.59 65.67,11.49
  Top 0.406: J1.2 72.02,3.44 GFCI.2
N$21
  Top 0.254: IC3.1 81,15.05 D3.A
N$22
  Top 0.61: R37.1 159.77,57.18 R36.2
N$23
  Top 0.254: C14.A 81.68,10.78 D3.C 79.18,10.68 R16.1 76.59,10.51 C7.2 74.02,10.46 R18.2
N$24
  Top 0.254: C16.2 69.85,20.06 | 69.85,20.06 R15.1 | IC3.6 71.2,17.59 | 69.85,20.06 69.85,18.94 71.2,17.59 | R14.2 68.89,17.59 71.2,17.59
N$25
  Top 0.254: IC3.7 69.12,16.32 67.85,15.05 65.92,15.05 65,15.96 65,17.31 62.91,19.4 D4.A
N$26
  Top 0.254: IC3.5 74.55,18.86 75.19,18.22 75.19,14.67 73.95,13.42 R18.1
N$27
  Top 0.406: IC4.4 76.41,22.15 C13.1
N$28
  Top 0.61: R39.1 R38.2
N$29
  Top 0.305: R36.1 153.55,57.21
  Top 0.61: 153.55,57.21 149.81,57.21 D9.A
N$30
  Top 0.61: R38.1 153.73,51.93 D10.A
N$31
  Top 0.406: R3.1 115.78,35.38 110.82,35.38 98.61,23.17 98.61,6.23 RGB_LED.3 95.03,2.65 86.26,2.65 83.72,5.2 U$24.P$2
N$32
  Top 0.406: R2.1 113.29,36.12 109.72,36.12 97.82,24.22 97.82,7.88 94.47,4.53 RGB_LED.2 94.47,6 93.81,6.66 82.94,6.66 82.05,5.78 82.05,4.81 83.66,3.2 U$24.P$3
N$33  (via drill 0.35)
  Top 0.305: LED1.3 38.7,35.33 38.72,35.34 v38.82,35.34 | v24.56,36.98 25.94,36.98 LED2.1
  Bottom 0.305: v38.82,35.34 26.12,35.34 24.52,36.94 v24.56,36.98
N$34
  Top 0.305: U2.6 49.59,31.95 C30.1
N$35
  Top 0.305: U2.5 49.45,31 C30.2 49.94,30.67 50.96,31.68 50.96,34.02 49.89,35.09 L1.P$1
N$36
  Top 0.406: R4.1 117.99,34.39 111.66,34.39 99.55,22.27 RGB_LED.4 96.78,1.61 83.78,1.61 82.18,3.2 U$24.P$1
PE
  Top 0.305: M4.P$1 167.58,5.93 167.82,5.93
  Top 1.27: U$3.P$1 197.44,5.98 G1.1 190.07,5.17 172.87,5.17 M3.P$1 172.11,5.93 167.82,5.93 | M4.P$1 167.53,5.02 163.91,1.41 152.79,1.41 | IC8.P$3 IC8.P$2 141.32,50.43 138.77,50.43 133.94,45.6 133.94,33.13 132.37,31.56 125.1,31.56 119.36,25.82 119.36,11.87 129.83,1.41 152.79,1.41 | C37.P$1 147.22,25.47 147.22,18.49 C38.P$1 147.12,14.55 147.12,7.07 152.79,1.41
PILOT  (via drill 0.35)
  Top 0.254: R7.2 82.18,44.99 R1.1 | v60.2,45.75 58.99,44.54 55.48,44.54 50.15,39.2 v50.07,39.28
  Top 0.305: v82.84,41.39 82.18,42.04 R7.2
  Top 0.406: TVS.C 28.46,23.87 28.46,22.41 | 28.46,22.41 U$20.P$1 | v34.39,21.3 29.57,21.3 28.46,22.41
  Top 0.61: U$20.P$1 26.37,14.21 19.74,14.21 15.53,18.42 JP6.1 15.09,8.42 U$25.P$3
  Bottom 0.254: 34.39,21.09 v34.39,21.3
  Bottom 0.305: v82.84,41.39 81.49,42.73 70.42,42.73 66.83,46.33 66.83,47.37 66.45,47.76 62.5,47.76 60.49,45.75 v60.2,45.75
  Bottom 0.406: v50.07,39.28 49.13,38.34 44.91,38.34 42.37,35.8 42.37,24.01 39.45,21.09 34.39,21.09
PILOTREAD
  Top 0.254: IC2.24 76.04,45.79 R6.1 76.52,45.36 76.84,45.04 78.77,45.04 80.38,43.44 R7.1 82.5,40.36 R5.1
PIX
  Top 0.305: LED2.3 30.88,35.4 31.3,35.82 31.3,37.8 30.69,38.41 22.97,38.41 21.57,37.02 19.99,37.02 JP3.3
PWM  (via drill 0.35)
  Top 0.254: IC1.3 87.44,38.55 86.57,37.68 v79.1,37.68
  Top 0.305: IC2.14 70.97,38.66 70.97,37.88 71.84,37.02 75.24,37.02 v75.28,37.06
  Bottom 0.254: v79.1,37.68 75.9,37.68 v75.28,37.06
RED
  Top 0.305: R2.2 114.69,39.31 115.26,39.31 117.02,41.08 IC5.27
RESET  (via drill 0.35)
  Top 0.254: 63.81,56.26 64.46,56.26 FTDI.6 65.59,55.66 67.6,57.67
  Top 0.305: C27.2 R10.1 63.81,56.26 | 67.6,57.67 v92.97,57.67 | v69.28,52.19 69.38,52.19 69.38,47.34 IC2.29
  Bottom 0.254: v69.28,52.19 69.16,52.32 67.69,52.32 65.59,54.42 FTDI.6
  Bottom 0.305: v92.97,57.67 93.96,57.67 95.23,56.4 95.23,53.94 ISP1.5
RX-I  (via drill 0.35)
  Top 0.254: X2.35 39.9,55.5 45.88,55.5 50.63,50.76 v50.73,50.76 | v56.83,48.63 60.41,52.21 66.83,52.21 67.59,52.97 FTDI.5
  Top 0.305: IC2.30 68.53,54.19 FTDI.5
  Bottom 0.254: v50.73,50.76 54.64,50.76 56.8,48.6 v56.83,48.63
RXD0
  Top 0.254: X2.34 39.98,53.96 45.86,53.96 50.61,49.21 D13.A
SCK
  Top 0.254: IC2.17 74.81,40.19 78,37.01 86.79,37.01 90.17,40.39 90.17,51.33 91.37,52.54 94.57,52.54 95.2,51.91 ISP1.3
SCL
  Top 0.254: 82.41,55.73 I2C.3
  Top 0.305: IC2.28 70.13,50.98 72.88,53.73 76.1,53.73 79.31,56.93 81.21,56.93 82.41,55.73 | I2C.3 82.83,55.73 84.75,53.81 87.35,53.81 89.86,56.32 95.66,56.32 99.11,52.87 103.61,52.87 104.32,52.16 IC5.12 104.32,49.29 102.67,47.63 R12.1
SDA
  Top 0.305: IC2.27 70.93,50.77 73.31,53.15 76.88,53.15 79.46,55.73 I2C.4 82.77,53.35 87.74,53.35 90.02,55.64 95.15,55.64 99.66,51.13 R11.1 102.62,50.33 103.05,50.76 IC5.13
TX  (via drill 0.35)
  Top 0.254: v65.61,53.04 65.61,53.53 63.79,55.36 62.19,55.36 56.04,49.21 D13.C | IC2.31 67.73,51.2 67.75,51.22 67.75,51.24 v67.7,51.29
  Bottom 0.254: v65.61,53.04 65.67,53.1 65.77,53.1 67.57,51.29 v67.7,51.29 69.53,51.29 70.31,52.08 70.31,54.41 FTDI.4
UGND
  Top 0.305: 72.78,43.42 72.8,43.39 IC2.21 76.28,43.39 76.36,43.47
  Top 0.406: 64.12,44.48 64.41,44.19 IC2.3 66.72,44.19 66.91,44 66.91,42.73 66.77,42.59 IC2.5
  Top 0.61: C12.2 C20.2 77.86,43.49 | 77.86,43.49 | SH2.2 61.3,41.14 C18.1 61.3,43.57 C17.- 61.33,45.28 C19.1 61.27,46.8 SH1.1
  pour Top (isolate 0.305, rank 2): 59.85,45.96 63.14,49.25 71.54,49.25 71.54,48.32 75.53,44.33 78.45,44.33 78.45,42.49 74.74,42.49 74.74,37.52 74.34,37.12 66.74,37.12 66.5,37.36 66.5,39.36 65.94,39.92 59.85,39.92
VCC
  Top 0.254: C18.2 63.03,41.73 63.03,41.74
  Top 0.305: R27.1 63.32,45.59 C19.2 63.07,43.64 C17.+ | C17.+ 63.03,41.74 | C17.+ 63.23,43.39 64.52,43.39 | 64.52,43.39 IC2.4 | IC2.6 64.47,41.79 64.19,42.07 64.19,43.06 64.52,43.39
WELD_DETECT  (via drill 0.35)
  Top 0.254: v69.02,45.6 68.97,45.55 67.34,45.55 67.1,45.79 IC2.1 | v116.19,49.67 116.22,49.71 126.34,49.71 129.49,52.85 IC8.P$6
  Bottom 0.254: v69.02,45.6 69.14,45.49 92.24,45.49 92.25,45.49 109.65,45.49 113.9,49.74 116.11,49.74 v116.19,49.67
XGND
  pour Top (isolate 0.254): 65.8,39.67 60.9,39.67 60.2,38.97 60.2,32.67 60.5,32.37 64.4,32.37 65.2,33.17 65.2,34.67 65.8,34.67

### Text on the board
tNames: AC TEST | AC TEST | AC TEST | AC RELAY | AC RELAY | _ | Test Coil | PILOT | _ | PILOT | AC INPUT | Ground | 12v Relay | AC INPUT | PILOT | _ | Test Coil | Red | Green | Blue | F1 | 12v Relay | Test Coil | AMP CT
bNames: AC | PS1